# Altium schematic sheet 07 eMMC.SchDoc: eMMC
size 420 x 297 mm; SheetNumber: 7; SheetTotal: 11
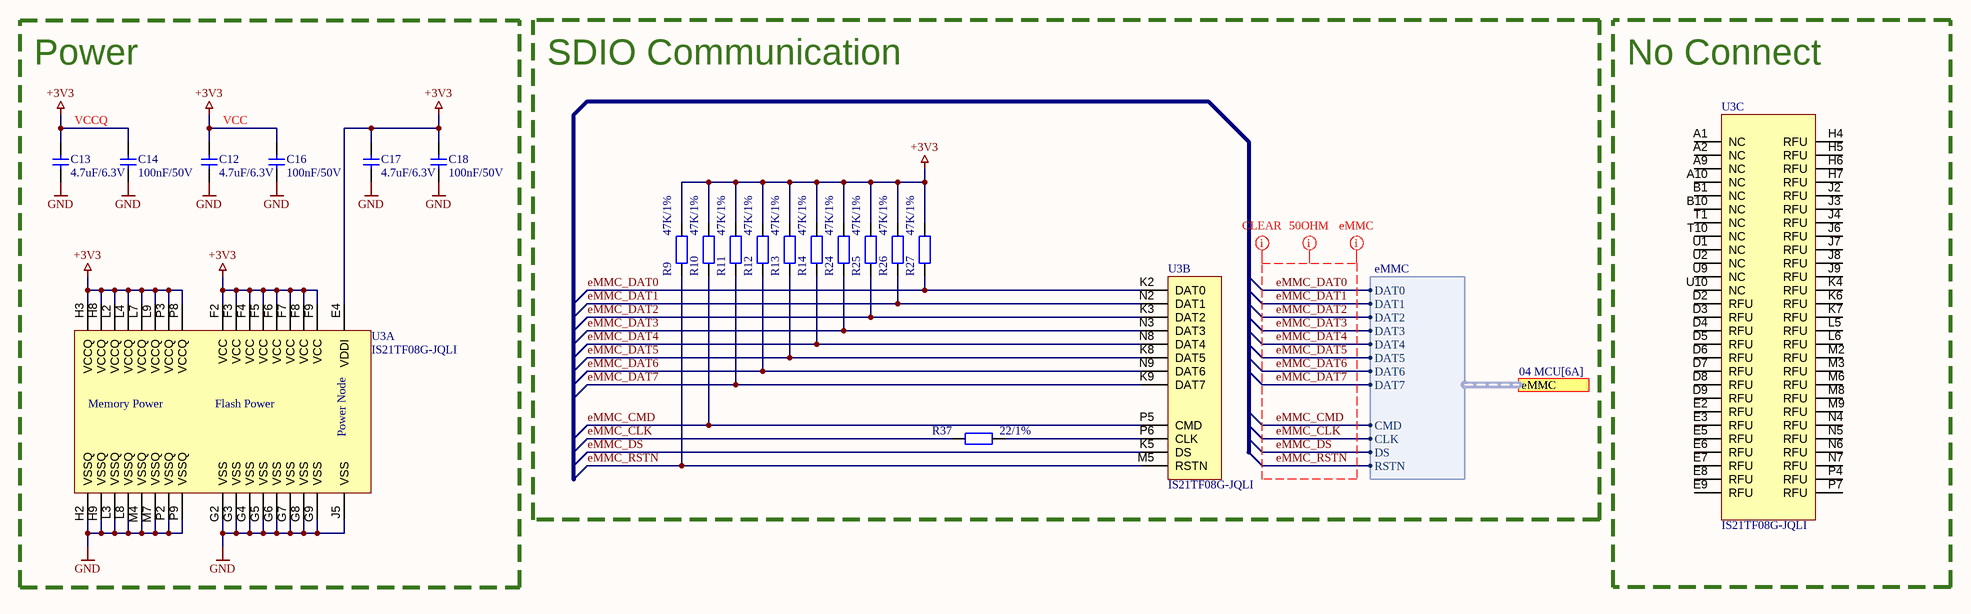
[diagram p0: 07 eMMC.SchDoc]

## Parts
C12  4.7uF/6.3V  [CAPC1005X06M-0402]
C13  4.7uF/6.3V  [CAPC1005X06M-0402]
C14  100nF/50V  [CAPC1005X06M-0402]
C16  100nF/50V  [CAPC1005X06M-0402]
C17  4.7uF/6.3V  [CAPC1005X06M-0402]
C18  100nF/50V  [CAPC1005X06M-0402]
R9  47K/1%  [RESC1005X04M-0402]
R10  47K/1%  [RESC1005X04M-0402]
R11  47K/1%  [RESC1005X04M-0402]
R12  47K/1%  [RESC1005X04M-0402]
R13  47K/1%  [RESC1005X04M-0402]
R14  47K/1%  [RESC1005X04M-0402]
R24  47K/1%  [RESC1005X04M-0402]
R25  47K/1%  [RESC1005X04M-0402]
R26  47K/1%  [RESC1005X04M-0402]
R27  47K/1%  [RESC1005X04M-0402]
R37  22/1%  [RESC1005X04M-0402]
U3  IS21TF08G-JQLI  [BGA180C100P10X18_1400X1400X140]  (parts A,B,C of 3)

## Blocks framed on the sheet
Power: C12-C14 C16-C18 U3
SDIO Communication: R9-R14 R24-R27 R37 U3
No Connect: U3

## Ports
eMMC (harness eMMC, see 04 MCU[6A])

## Harnesses
eMMC: DAT0, DAT1, DAT2, DAT3, DAT4, DAT5, DAT6, DAT7, CMD, CLK, DS, RSTN

## Nets
+3V3: C12.2 C13.2 C14.2 C16.2 C17.2 C18.2 R9.2 R10.2 R11.2 R12.2 R13.2 R14.2 R24.2 R25.2 R26.2 R27.2 U3.E4(VDDI) U3.F2(VCC) U3.F3(VCC) U3.F4(VCC) U3.F5(VCC) U3.F6(VCC) U3.F7(VCC) U3.F8(VCC) U3.F9(VCC) U3.H3(VCCQ) U3.H8(VCCQ) U3.L2(VCCQ) U3.L4(VCCQ) U3.L7(VCCQ) U3.L9(VCCQ) U3.P3(VCCQ) U3.P8(VCCQ)
GND: C12.1 C13.1 C14.1 C16.1 C17.1 C18.1 U3.G2(VSS) U3.G3(VSS) U3.G4(VSS) U3.G5(VSS) U3.G6(VSS) U3.G7(VSS) U3.G8(VSS) U3.G9(VSS) U3.H2(VSSQ) U3.H9(VSSQ) U3.J5(VSS) U3.L3(VSSQ) U3.L8(VSSQ) U3.M4(VSSQ) U3.M7(VSSQ) U3.P2(VSSQ) U3.P9(VSSQ)
eMMC_CLK: R37.1 ; port eMMC.CLK
eMMC_CMD: R10.1 U3.P5(CMD) ; port eMMC.CMD
eMMC_DAT0: R27.1 U3.K2(DAT0) ; port eMMC.DAT0
eMMC_DAT1: R26.1 U3.N2(DAT1) ; port eMMC.DAT1
eMMC_DAT2: R25.1 U3.K3(DAT2) ; port eMMC.DAT2
eMMC_DAT3: R24.1 U3.N3(DAT3) ; port eMMC.DAT3
eMMC_DAT4: R14.1 U3.N8(DAT4) ; port eMMC.DAT4
eMMC_DAT5: R13.1 U3.K8(DAT5) ; port eMMC.DAT5
eMMC_DAT6: R12.1 U3.N9(DAT6) ; port eMMC.DAT6
eMMC_DAT7: R11.1 U3.K9(DAT7) ; port eMMC.DAT7
eMMC_DS: U3.K5(DS) ; port eMMC.DS
eMMC_RSTN: R9.1 U3.M5(RSTN) ; port eMMC.RSTN
NetR37_2: R37.2 U3.P6(CLK)

Not connected (* = marked no-connect by the designer): U3 A1(NC) A2(NC) A9(NC) A10(NC) B1(NC) B10(NC) D2(RFU) D3(RFU) D4(RFU) D5(RFU) D6(RFU) D7(RFU) D8(RFU) D9(RFU) E2(RFU) E3(RFU) E5(RFU) E6(RFU) E7(RFU) E8(RFU) E9(RFU) H4(RFU) H5(RFU) H6(RFU) H7(RFU) J2(RFU) J3(RFU) J4(RFU) J6(RFU) J7(RFU) J8(RFU) J9(RFU) K4(RFU) K6(RFU) K7(RFU) L5(RFU) L6(RFU) M2(RFU) M3(RFU) M6(RFU) M8(RFU) M9(RFU) N4(RFU) N5(RFU) N6(RFU) N7(RFU) P4(RFU) P7(RFU) T1(NC) T10(NC) U1(NC) U2(NC) U9(NC) U10(NC)

## Layout directives
net class eMMC: eMMC_CLK, eMMC_CMD, eMMC_DAT0, eMMC_DAT1, eMMC_DAT2, eMMC_DAT3, eMMC_DAT4, eMMC_DAT5, eMMC_DAT6, eMMC_DAT7, eMMC_DS, eMMC_RSTN
net class 50OHM: eMMC_CLK, eMMC_CMD, eMMC_DAT0, eMMC_DAT1, eMMC_DAT2, eMMC_DAT3, eMMC_DAT4, eMMC_DAT5, eMMC_DAT6, eMMC_DAT7, eMMC_DS, eMMC_RSTN
net class CLEAR: eMMC_CLK, eMMC_CMD, eMMC_DAT0, eMMC_DAT1, eMMC_DAT2, eMMC_DAT3, eMMC_DAT4, eMMC_DAT5, eMMC_DAT6, eMMC_DAT7, eMMC_DS, eMMC_RSTN

## Notes on the sheet
- VCCQ
- VCC
- Title
- Project
- Size
- Date
- Revision
- A3
- Designed By
- (in symbol IS21TF08G-JQLI, part A) Memory Power; Flash Power; Power Node

## Library data of the parts
C12 C13 C17 = GRM155R60J475ME47D: 4.7 µF ±20% 6.3V Ceramic Capacitor X5R 0402 (1005 Metric); ComponentLink1Description: Datasheet; ComponentLink1URL: https://search.murata.co.jp/Ceramy/image/img/A01X/G101/ENG/GRM155R60J475ME47-01.pdf; MPN: GRM155R60J475ME47D
C14 C16 C18 = GRM155R71H104KE14D: 0.1 µF ±10% 50V Ceramic Capacitor X7R 0402 (1005 Metric); ComponentLink1Description: Datasheet; ComponentLink1URL: https://search.murata.co.jp/Ceramy/image/img/A01X/G101/ENG/GRM155R60J475ME47-01.pdf; MPN: GRM155R71H104KE14D
R9-R14 R24-R27 = RC0402FR-0747KL: 47 kOhms ±1% 0.063W, 1/16W Chip Resistor 0402 (1005 Metric) Moisture Resistant Thick Film; ComponentLink1Description: Datasheet; ComponentLink1URL: https://www.yageo.com/upload/media/product/productsearch/datasheet/rchip/PYu-RC_Group_51_RoHS_L_12.pdf; MPN: RC0402FR-0747KL
R37 = RC0402FR-0722RL: 22 Ohms ±1% 0.063W, 1/16W Chip Resistor 0402 (1005 Metric) Moisture Resistant Thick Film; ComponentLink1Description: Datasheet; ComponentLink1URL: https://www.yageo.com/upload/media/product/productsearch/datasheet/rchip/PYu-RC_Group_51_RoHS_L_12.pdf; MPN: RC0402FR-0722RL
U3 = IS21TF08G-JQLI: FLASH - NAND (TLC) Memory IC 64Gbit MMC 200 MHz 100-LFBGA (14x18); ComponentLink1Description: Datasheet; ComponentLink1URL: https://www.issi.com/WW/pdf/21-22TF08G.pdf; MPN: IS21TF08G-JQLI